# Altium schematic sheet Analog Input.SchDoc
size A4; SheetNumber: 6; SheetTotal: 10
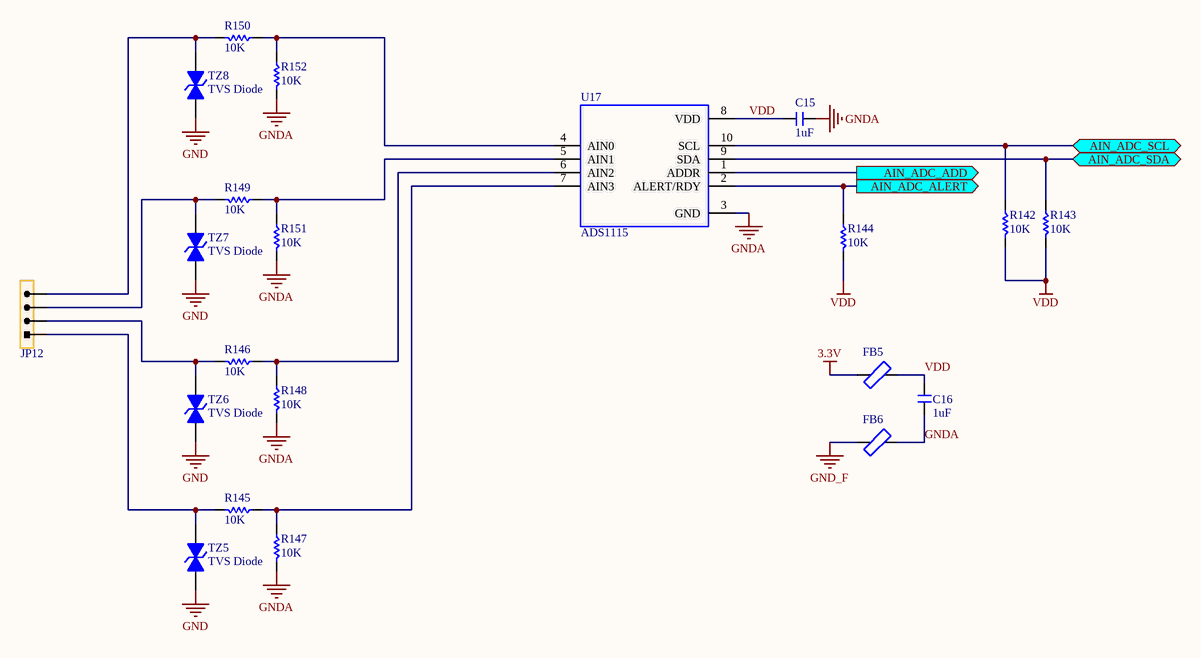
[diagram p0: Analog Input.SchDoc]

## Parts
C15  1uF  [C 0805]
C16  1uF  [C 0805]
FB5  (no value)  [F 0805]
FB6  (no value)  [F 0805]
JP12  HDR-1X4  [KF-4P-BLK-H-3.81]  (value not drawn)
R142  10K  [R 0805]
R143  10K  [R 0805]
R144  10K  [R 0805]
R145  10K  [R 0805]
R146  10K  [R 0805]
R147  10K  [R 0805]
R148  10K  [R 0805]
R149  10K  [R 0805]
R150  10K  [R 0805]
R151  10K  [R 0805]
R152  10K  [R 0805]
TZ5  TVS Diode  [SMB]
TZ6  TVS Diode  [SMB]
TZ7  TVS Diode  [SMB]
TZ8  TVS Diode  [SMB]
U17  ADS1115  [VSSOP10-N]

## Ports
AIN_ADC_ADD (out), AIN_ADC_ALERT (out), AIN_ADC_SCL (bidir), AIN_ADC_SDA (bidir)

## Nets
3.3V: FB5.1
GND: TZ5.1(A) TZ6.1(A) TZ7.1(A) TZ8.1(A)
GND_F: FB6.1
GNDA: C15.1 C16.1 FB6.2 R147.2 R148.2 R151.2 R152.2 U17.3(GND)
VDD: C15.2 C16.2 FB5.2 R142.2 R143.2 R144.2 U17.8(VDD)
AIN_ADC_ADD: U17.1(ADDR) ; port AIN_ADC_ADD
AIN_ADC_ALERT: R144.1 U17.2(ALERT/RDY) ; port AIN_ADC_ALERT
AIN_ADC_SCL: R142.1 U17.10(SCL) ; port AIN_ADC_SCL
AIN_ADC_SDA: R143.1 U17.9(SDA) ; port AIN_ADC_SDA
NetJP12_1: JP12.1 R145.2 TZ5.2(K)
NetJP12_2: JP12.2 R146.2 TZ6.2(K)
NetJP12_3: JP12.3 R149.2 TZ7.2(K)
NetJP12_4: JP12.4 R150.2 TZ8.2(K)
NetR145_1: R145.1 R147.1 U17.7(AIN3)
NetR146_1: R146.1 R148.1 U17.6(AIN2)
NetR149_1: R149.1 R151.1 U17.5(AIN1)
NetR150_1: R150.1 R152.1 U17.4(AIN0)

## Library data of the parts
C15 C16 = C: Non-polar patch capacitor; BOM名称: 无极性贴片电容; 版权归属: 源创客; 学习资源: www.ooocke.com
FB5 FB6 = FB: Ferrite Bead; BOM名称: 贴片电阻; 版权归属: 源创客; 学习资源: www.ooocke.com
JP12 = Header 4: 4P Connector; BOM名称: 4P接插件; 版权归属: 源创客; 学习资源: www.ooocke.com
R142-R152 = R: Chip resistor; 版权归属: 源创客; BOM名称: Chip resistor; 学习资源: www.ooocke.com
TZ5-TZ8 = SMBJ-CA: Surface Mount TRANSZORB® Transient Voltage Suppressors
U17 = ADS1115: ADS111x Ultra-Small, Low-Power, I / 2C-Compatible, 860-SPS, 16-Bit ADCs / With Internal Reference, Oscillator, and Programmable Comparator; BOM名称: 数字电位器; 版权归属: 源创客; 学习资源: www.ooocke.com